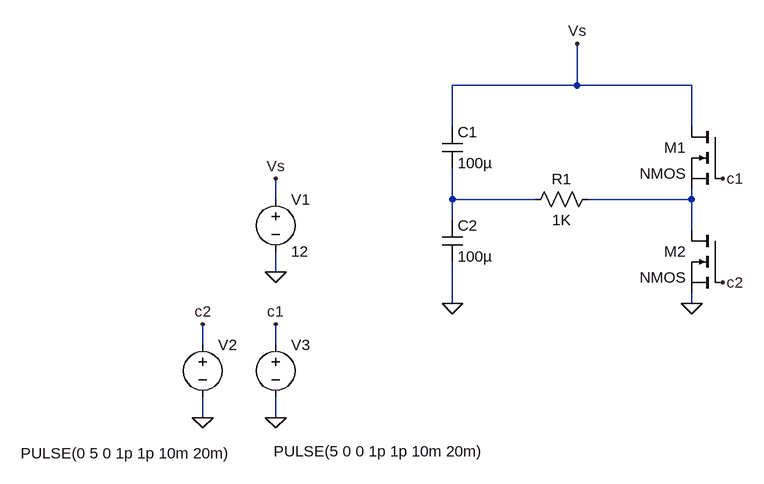
[diagram p0: schematic Meia Ponte.asc]
Meia Ponte.asc, the LTspice schematic file:
Version 4
SHEET 1 880 680
WIRE 496 -48 496 -112
WIRE 496 -48 304 -48
WIRE 672 -48 496 -48
WIRE 304 16 304 -48
WIRE 672 16 672 -48
WIRE 32 128 32 96
WIRE 304 128 304 80
WIRE 432 128 304 128
WIRE 672 128 672 112
WIRE 672 128 512 128
WIRE 304 160 304 128
WIRE 672 176 672 128
WIRE 32 240 32 208
WIRE 304 288 304 224
WIRE 672 288 672 272
WIRE -80 352 -80 320
WIRE 32 352 32 320
WIRE -80 464 -80 432
WIRE 32 464 32 432
FLAG 32 240 0
FLAG 32 96 Vs
FLAG 304 288 0
FLAG 672 288 0
FLAG 496 -112 Vs
FLAG 32 464 0
FLAG -80 464 0
FLAG 720 96 c1
FLAG 32 320 c1
FLAG -80 320 c2
FLAG 720 256 c2
SYMBOL voltage 32 112 R0
WINDOW 123 0 0 Left 0
WINDOW 39 0 0 Left 0
SYMATTR InstName V1
SYMATTR Value 12
SYMBOL cap 288 16 R0
SYMATTR InstName C1
SYMATTR Value 100µ
SYMBOL cap 288 160 R0
SYMATTR InstName C2
SYMATTR Value 100µ
SYMBOL res 528 112 R90
WINDOW 0 0 56 VBottom 2
WINDOW 3 32 56 VTop 2
SYMATTR InstName R1
SYMATTR Value 1K
SYMBOL nmos 720 16 M0
SYMATTR InstName M1
SYMBOL nmos 720 176 M0
SYMATTR InstName M2
SYMBOL voltage -80 336 R0
WINDOW 3 -280 183 Left 2
WINDOW 123 0 0 Left 0
WINDOW 39 0 0 Left 0
SYMATTR InstName V2
SYMATTR Value PULSE(0 5 0 1p 1p 10m 20m)
SYMBOL voltage 32 336 R0
WINDOW 3 -3 180 Left 2
WINDOW 123 0 0 Left 0
WINDOW 39 0 0 Left 0
SYMATTR InstName V3
SYMATTR Value PULSE(5 0 0 1p 1p 10m 20m)

The netlist it stands for:
* Meia Ponte.asc
V1 Vs 0 12
C1 Vs N001 100µ
C2 N001 0 100µ
R1 N002 N001 1K
M1 Vs c1 N002 N002 NMOS
M2 N002 c2 0 0 NMOS
V2 c2 0 PULSE(0 5 0 1p 1p 10m 20m)
V3 c1 0 PULSE(5 0 0 1p 1p 10m 20m)
.model NMOS NMOS
.model PMOS PMOS
.lib standard.mos
.backanno
.end